# EAGLE design HexBoard (EAGLE 7.1.0)
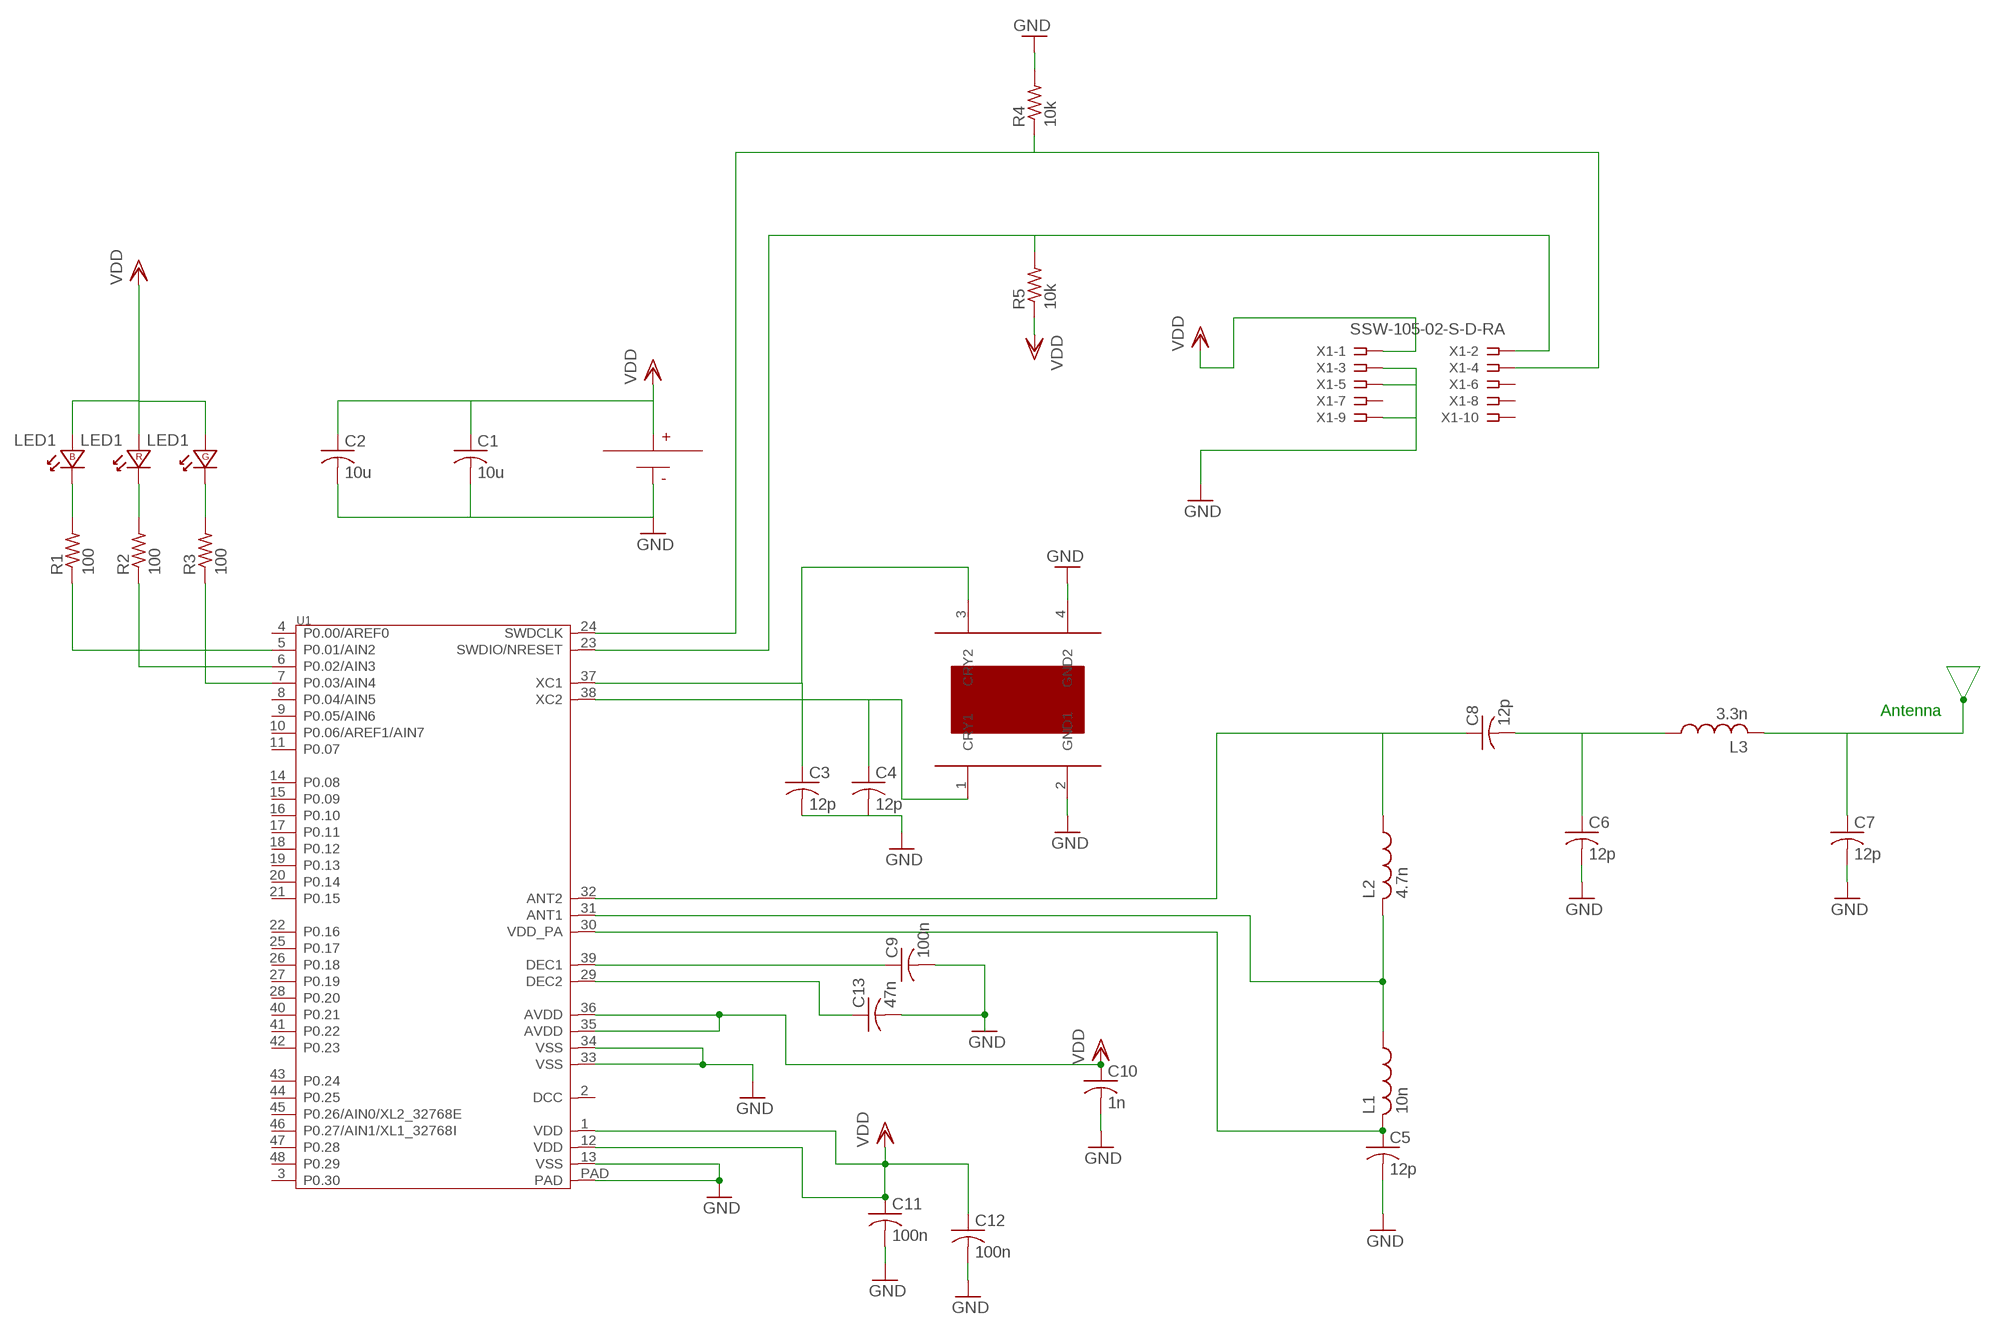
[diagram p0: schematic, sheet 1]

## Parts
B1  CON-COINCEL-HOLDER-KEYSTONE-3012TR  [16MM-COINCELL-KEYSTONE]
C1  10u  C-USC0805K  [C0805K]
C2  10u  C-USC0805K  [C0805K]
C3  12p  C-USC0402  [C0402]
C4  12p  C-USC0402  [C0402]
C5  12p  C-USC0402  [C0402]
C6  12p  C-USC0402  [C0402]
C7  12p  C-USC0402  [C0402]
C8  12p  C-USC0402  [C0402]
C9  100n  C-USC0402  [C0402]
C10  1n  C-USC0402  [C0402]
C11  100n  C-USC0402  [C0402]
C12  100n  C-USC0402  [C0402]
C13  47n  C-USC0603K  [C0603K]
L1  10n  402_CHIP_INDUCTOR  [CHIP_INDUCTOR]
L2  4.7n  402_CHIP_INDUCTOR  [CHIP_INDUCTOR]
L3  3.3n  402_CHIP_INDUCTOR  [CHIP_INDUCTOR]
LED1  LED-RGB-SEPARATE-3528  [LED-3528]
R1  100  R-US_R0402  [R0402]
R2  100  R-US_R0402  [R0402]
R3  100  R-US_R0402  [R0402]
R4  10k  R-US_R0402  [R0402]
R5  10k  R-US_R0402  [R0402]
U1  NRF51822  [QFN48-6X6MM]
U$1  TXC-CRYSTAL  [TXC_CRYSTAL]
X1  SSW-105-02-S-D-RA  [TSW-105-02-S-D-RA]

## Nets
ANTENNA: C7.1 L3.2
GND: B1.NEG C1.2 C2.2 C3.2 C4.2 C5.2 C6.2 C7.2 C9.2 C10.2 C11.2 C12.2 C13.2 R4.2 U1.13(VSS) U1.33(VSS) U1.34(VSS) U1.PAD U$1.2(GND1) U$1.4(GND2) X1.3 X1.5 X1.9
N$1: LED1.6(B:K) R1.2
N$2: LED1.5(R:K) R2.2
N$3: LED1.4(G:K) R3.2
N$4: R1.1 U1.5(P0.01/AIN2)
N$5: R2.1 U1.6(P0.02/AIN3)
N$6: R3.1 U1.7(P0.03/AIN4)
N$7: R4.1 U1.24(SWDCLK) X1.4
N$8: C3.1 U1.37(XC1) U$1.3(CRY2)
N$9: C4.1 U1.38(XC2) U$1.1(CRY1)
N$10: R5.2 U1.23(SWDIO/NRESET) X1.2
N$11: L1.1 L2.2 U1.31(ANT1)
N$12: C9.1 U1.39(DEC1)
N$13: C6.1 C8.2 L3.1
N$15: C8.1 L2.1 U1.32(ANT2)
N$17: C5.1 L1.2 U1.30(VDD_PA)
N$18: C13.1 U1.29(DEC2)
VDD: B1.POS@1(POS) B1.POS@2(POS) C1.1 C2.1 C10.1 C11.1 C12.1 LED1.1(B:A) LED1.2(R:A) LED1.3(G:A) R5.1 U1.1(VDD) U1.12(VDD) U1.35(AVDD) U1.36(AVDD) X1.1
Unconnected: U1.2(DCC) U1.3(P0.30) U1.4(P0.00/AREF0) U1.8(P0.04/AIN5) U1.9(P0.05/AIN6) U1.10(P0.06/AREF1/AIN7) U1.11(P0.07) U1.14(P0.08) U1.15(P0.09) U1.16(P0.10) U1.17(P0.11) U1.18(P0.12) U1.19(P0.13) U1.20(P0.14) U1.21(P0.15) U1.22(P0.16) U1.25(P0.17) U1.26(P0.18) U1.27(P0.19) U1.28(P0.20) U1.40(P0.21) U1.41(P0.22) U1.42(P0.23) U1.43(P0.24) U1.44(P0.25) U1.45(P0.26/AIN0/XL2_32768E) U1.46(P0.27/AIN1/XL1_32768I) U1.47(P0.28) U1.48(P0.29) X1.6 X1.7 X1.8 X1.10

## Notes on the sheet
- Antenna

## Library data of the parts
B1 = 16mm-coincell-keystone:CON-COINCEL-HOLDER-KEYSTONE-3012TR
C1-C13 = adafruit:C-US: CAPACITOR, American symbol
L1-L3 = CHIP_INDUCTOR:402_CHIP_INDUCTOR
LED1 = rgb-led-separate:LED-RGB-SEPARATE-*: RGB LED with separate contacts for all 3 chips
R1-R5 = adafruit:R-US_: RESISTOR, American symbol
U1 = nrf51822:NRF51822: Multi-protocol Blutooth 4.0 low energy /2. GHz RF SoC
U$1 = TXC:TXC-CRYSTAL: 4-SMD Crystal 2.5mm x 2.0mm
X1 = con-samtec:SSW-105-02-S-D: THROUGH-HOLE .025" SQ POST SOCKET Source: Samtec SSW.pdf; MPN: SSW-105-02-S-D-RA; OC_FARNELL: unknown; OC_NEWARK: 18M6953

## Net classes
0 default: width 0.102 mm, drill 0.203 mm, clearance 0.102 mm

## Board
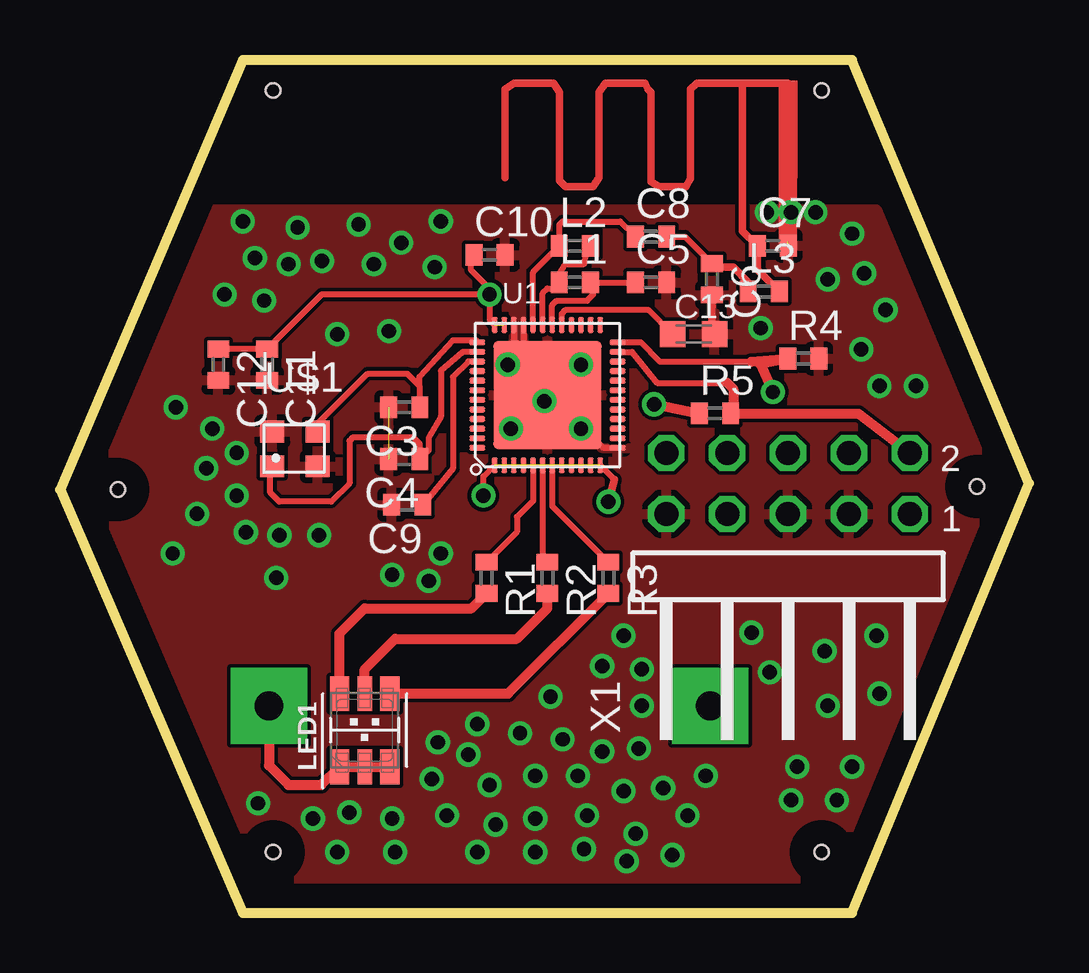
[diagram p1: board, top side]
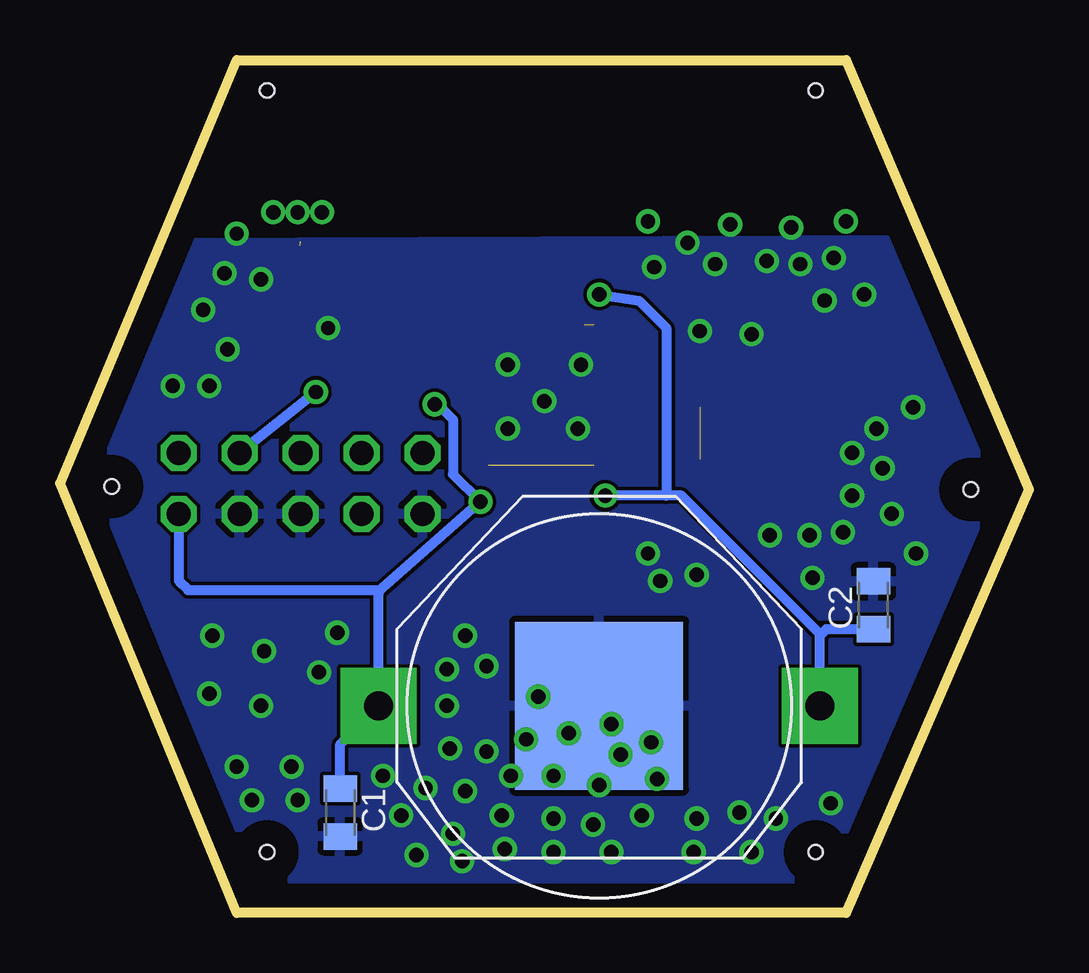
[diagram p2: board, bottom side, seen from below]

Size 40.39 x 35.56 mm. Coordinates in mm from the lower left corner, seen from the top.
Outline: 0,17.65 7.62,0 33.02,0 40.39,17.91 33.02,35.56 7.62,35.56 0,17.65
Copper layers (1*16): Top 0.035mm / dielectric 1.5mm / Bottom 0.035mm
Design rules "default *": minimum track width 10mil, minimum drill 24mil, track to track 6mil, track to pad 6mil, pad to pad 6mil, via to via 6mil, smd to smd 6mil, copper to edge 40mil, drill to drill 8mil, minimum pad ring 10mil, minimum via ring 8mil, stop-mask expansion 4mil, vias tented up to drill 0mil, thermal gap 10mil
Holes 0.6 mm at 8.89,2.54 31.75,2.54 38.23,17.78 31.75,34.29 8.89,34.29 2.41,17.65

### Footprints (pad centres in the part's own frame; a part is rotated, then mirrored left to right if it is on the bottom)
16MM-COINCELL-KEYSTONE = smd 7 x 7: NEG 0,0 | drill 1.2 pad 3.175 square: POS@1 -9.195,0; POS@2 9.195,0
C0805K = smd 1.1 x 1.4: 1 -1,0; 2 1,0
C0402 = smd 0.7 x 0.9: 1 -0.65,0; 2 0.65,0
C0603K = smd 1.05 x 1.08: 1 -0.875,0; 2 0.875,0
CHIP_INDUCTOR = smd 0.7 x 0.9: 1 0.62,2.54; 2 1.92,2.54
LED-3528 = smd 1.45 x 0.8: 1 -1.525,1.05; 3 -1.525,-1.05; 4 1.525,-1.05; 6 1.525,1.05 | smd 1.45 x 0.6: 2 -1.525,0; 5 1.525,0
R0402 = smd 0.7 x 0.9: 1 -0.65,0; 2 0.65,0
QFN48-6X6MM = smd 0.23 x 0.65: 1 -2.2,-2.925; 2 -1.8,-2.925; 3 -1.4,-2.925; 4 -1,-2.925; 5 -0.6,-2.925; 6 -0.2,-2.925; 7 0.2,-2.925; 8 0.6,-2.925; 9 1,-2.925; 10 1.4,-2.925; 11 1.8,-2.925; 12 2.2,-2.925; 25 2.2,2.925; 26 1.8,2.925; 27 1.4,2.925; 28 1,2.925; 29 0.6,2.925; 30 0.2,2.925; 31 -0.2,2.925; 32 -0.6,2.925; 33 -1,2.925; 34 -1.4,2.925; 35 -1.8,2.925; 36 -2.2,2.925 | smd 0.65 x 0.23: 13 2.925,-2.2; 14 2.925,-1.8; 15 2.925,-1.4; 16 2.925,-1; 17 2.925,-0.6; 18 2.925,-0.2; 19 2.925,0.2; 20 2.925,0.6; 21 2.925,1; 22 2.925,1.4; 23 2.925,1.8; 24 2.925,2.2; 37 -2.925,2.2; 38 -2.925,1.8; 39 -2.925,1.4; 40 -2.925,1; 41 -2.925,0.6; 42 -2.925,0.2; 43 -2.925,-0.2; 44 -2.925,-0.6; 45 -2.925,-1; 46 -2.925,-1.4; 47 -2.925,-1.8; 48 -2.925,-2.2 | smd 4.5 x 4.5: PAD 0,0
TXC_CRYSTAL = smd 1 x 0.9: 1 0.34,3.76; 2 2.24,3.76; 3 2.24,5.21; 4 0.34,5.21
TSW-105-02-S-D-RA = drill 1 pad 1.5 octagon: 1 5.08,1.524; 2 5.08,4.064; 3 2.54,1.524; 4 2.54,4.064; 5 0,1.524; 6 0,4.064; 7 -2.54,1.524; 8 -2.54,4.064; 9 -5.08,1.524; 10 -5.08,4.064

### Placement (x,y rotation side)
B1  17.91,8.64 180 bottom
C1  28.7,4.19 270 bottom
C2  6.48,12.83 90 bottom
C3  14.35,21.08 180 top
C4  14.35,18.92 180 top
C5  24.64,26.29 0 top
C6  27.18,26.42 270 top
C7  29.72,27.81 0 top
C8  24.64,28.19 0 top
C9  14.48,17.02 180 top
C10  17.91,27.43 0 top
C11  8.64,22.86 270 top
C12  6.6,22.86 270 top
C13  26.42,24.13 0 top
L1  20.19,23.75 0 top
L2  20.19,25.27 0 top
L3  28.07,23.37 0 top
LED1  12.7,7.62 90 top
R1  17.78,13.97 270 top
R2  20.32,13.97 270 top
R3  22.86,13.97 270 top
R4  30.99,23.11 0 top
R5  27.3,20.83 0 top
U1  20.32,21.59 0 top
U$1  8.51,14.86 0 top
X1  30.35,15.11 0 top

### Tracks (layer width: path | path; a pad name or v marks a point on that pad's centre or on a via)
ANTENNA
  Top 0.305: 28.45,34.59 28.45,28.43 C7.1 29.07,26.83 L3.2 | 28.45,34.59 26.54,34.59 26.29,34.34 26.29,30.61 26.09,30.28 24.97,30.28 24.64,30.48 24.64,34.21 24.51,34.34 24.38,34.59 22.73,34.59 22.48,34.21 22.48,30.66 22.23,30.28 21.08,30.28 20.83,30.53 20.83,34.21 20.57,34.59 18.92,34.59 18.54,34.34 18.54,30.66 | 28.45,34.59 30.35,34.59
GND  (via drill 0.6)  (2 unrouted)
  Top 0.254: U1.13 22.65,19.39 21.59,20.45 | U1.33 19.32,23.5 18.92,23.89 U1.34
  Top 0.305: C6.2 27.18,24.24 C13.2 27.43,24.13
  Top 0.406: 21.59,20.45 21.46,20.45 U1.PAD 19.56,22.35 19.56,22.73 19.32,22.97 19.32,23.5
  Top 0.762: 30.35,27.99 30.35,30.79
  other vias: 29.21,24.38 18.67,22.86 21.72,22.86 18.8,20.19 21.72,20.19 20.19,21.34 33.02,28.32 32,26.42 33.53,26.67 34.42,25.15 33.4,23.5 35.69,21.97 34.16,21.97 29.46,29.21 30.48,29.21 31.5,29.21 15.88,28.83 15.62,26.92 14.22,27.94 12.45,28.7 13.08,27.05 10.92,27.18 9.91,28.57 9.52,27.05 7.62,28.83 8.13,27.3 6.86,25.78 8.51,25.53 11.56,24.13 13.72,24.26 4.83,21.08 6.35,20.19 7.37,19.18 6.1,18.54 7.37,17.4 5.71,16.64 4.7,14.99 9.14,15.75 7.75,15.88 10.79,15.75 9.02,13.97 13.84,14.1 15.88,14.99 15.37,13.84 15.75,7.11 10.54,3.94 12.06,4.19 11.56,2.54 8.25,4.57 13.84,3.94 13.97,2.54 16.13,4.06 15.49,5.59 17.02,6.6 17.4,7.87 17.91,5.33 18.16,3.68 17.4,2.54 19.81,2.54 19.81,3.94 19.81,5.71 19.18,7.49 20.45,9.02 22.61,10.29 23.49,11.56 24.26,10.16 24.26,8.64 22.61,6.73 20.95,7.24 21.59,5.71 21.97,4.06 21.84,2.67 23.49,5.08 24.13,6.86 25.15,5.21 24,3.3 23.62,2.16 25.53,2.41 26.16,4.06 26.92,5.71 30.73,6.1 30.48,4.7 32.38,4.7 33.02,6.1 32,8.64 31.88,10.92 28.83,11.68 29.59,10.03 34.04,11.56 34.16,9.14
  pour Bottom: 0.38,17.78 7.62,0 33.02,0 39.88,17.78 35.56,27.94 5.08,28.07
  pour Top: 0.38,17.78 6.1,29.34 34.04,29.34 40.13,17.78 33.02,0 7.62,0
N$1
  Top 0.406: LED1.6 11.65,11.65 12.7,12.7 17.16,12.7 R1.2
N$2
  Top 0.406: LED1.5 12.7,10.16 13.97,11.43 19.05,11.43 20.32,12.7 R2.2
N$3
  Top 0.406: LED1.4 18.69,9.14 R3.2
N$4
  Top 0.254: U1.5 19.72,17.18 19.05,16.51 19.05,15.89 R1.1
N$5
  Top 0.254: U1.6 20.12,14.82 R2.1
N$6
  Top 0.254: U1.7 20.52,16.96 R3.1
N$7  (via drill 0.6 pad 0.25)
  Top 0.254: U1.24 24.2,23.79 24.22,23.79 25.02,22.99 28.81,22.99
  Top 0.406: v29.72,21.72 29.2,22.88 R4.1 28.81,22.99
  Bottom 0.406: v29.72,21.72 X1.4
N$8
  Top 0.254: U$1.3 10.75,20.4 12.83,22.48 14.48,22.48 14.99,21.97 | 14.99,21.97 14.99,21.1 C3.1 | 14.99,21.97 14.99,22.35 16.38,23.88 17.35,23.88 U1.37
N$9
  Top 0.254: U1.38 16.79,23.39 15.88,22.61 15.88,20.7 15.37,19.81 15.37,19.29 C4.1 15,19.54 14.73,19.81 12.19,19.81 12.06,19.68 12.06,17.91 11.3,17.14 9.14,17.14 8.76,17.53 8.76,18.53 U$1.1
N$10
  Top 0.254: U1.23 23.85,23.39 24.89,22.1 27.81,22.1
  Top 0.406: 27.81,22.1 28.07,21.84 28.07,20.81 | 28.07,20.81 R5.2 | 28.07,20.81 33.29,20.81 X1.2
N$11
  Top 0.254: U1.31 20.12,25.84 20.32,26.04 20.56,26.04 L1.1 20.81,26.66 21.08,27.05 21.84,27.05 21.97,27.54 L2.2
N$12
  Top 0.254: U1.39 17.02,22.99 16.38,22.35 16.38,18.53 C9.1
N$13
  Top 0.254: C8.2 26.05,28.19 C6.1
  Top 0.305: L3.1 28.69,26.3 28.07,26.92 27.32,26.92 C6.1
N$15
  Top 0.254: U1.32 19.72,26.72 L2.1 20.81,28.69 20.95,28.83 23.35,28.83 C8.1
N$17
  Top 0.254: U1.30 20.52,25.35 20.7,25.53 21.97,25.53 22.23,25.78 22.23,26.18 L1.2 C5.1
N$18
  Top 0.254: U1.29 20.92,24.98 21.08,25.15 24.52,25.15 C13.1
VDD  (via drill 0.6, 0.6 pad 0.25)  (2 unrouted)
  Top 0.254: v17.91,25.78 17.91,24.73 U1.36 | v17.65,17.4 17.65,18.2 U1.1 | 23.11,18.07 U1.12 | v17.91,25.78 10.91,25.78 C11.1 C12.1 | v17.91,25.78 17.91,26.04 17.15,26.8 17.15,27.32 C10.1
  Top 0.305: v22.86,17.14 23.11,18.07
  Top 0.406: v24.77,21.21 R5.1 | B1.POS@1 8.71,6.15 9.52,5.33 10.89,5.33 LED1.1 LED1.2 LED1.3
  Bottom 0.406: B1.POS@1 8.71,11.56 | 8.71,11.56 8.71,11.63 14.48,17.4 15.11,17.4 | 15.11,17.4 v17.65,17.4 | 27.1,13.34 B1.POS@2 28.7,7.04 C1.1 | 27.1,13.34 27.1,13.41 v22.86,17.14 24,18.29 24,20.57 24.64,21.21 v24.77,21.21 | C2.1 8.44,11.83 8.71,11.56 | v17.91,25.78 16.26,25.53 15.11,24.38 15.11,17.4 | X1.1 35.43,13.84 35.05,13.46 27.23,13.46 27.1,13.34
(copper drawn outside any net)
  shapes: Top area x1